# Altium schematic sheet WirlessSpeakerTop.SchDoc
size A4; Date: 27.05.2014; Author: AOM1; DrawnBy: AOM1; Organization: BFH; Address1: Berner Fachhochschule; Address2: Technik und Informatik; Address3: Jlcoweg 1; Address4: 3400 Burgdorf; DocumentNumber: 1; Revision: 1.0; SheetNumber: 1; SheetTotal: 6; CurrentDate: 27.05.2014
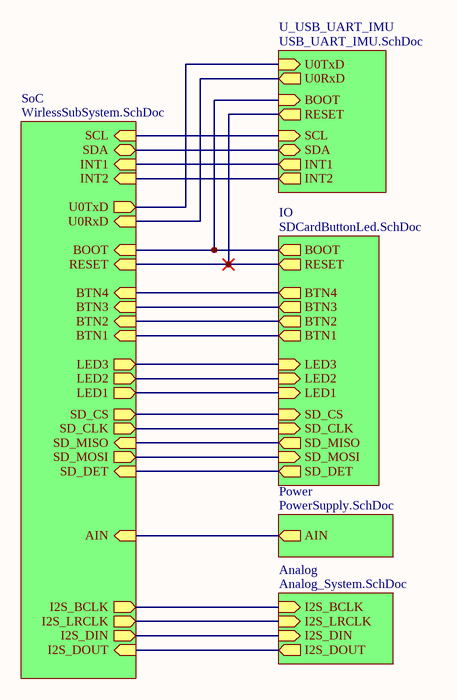
[diagram p0: WirlessSpeakerTop.SchDoc]

## Sub-sheets
Analog = Analog_System.SchDoc: I2S_BCLK (in), I2S_LRCLK (in), I2S_DIN (in), I2S_DOUT (out)
IO = SDCardButtonLed.SchDoc: BOOT (out), RESET (out), BTN1 (out), BTN2 (out), BTN3 (out), BTN4 (out), LED1 (in), LED2 (in), LED3 (in), SD_CS (in), SD_CLK (in), SD_MISO (out), SD_MOSI (in), SD_DET (out)
Power = PowerSupply.SchDoc: AIN (out)
SoC = WirlessSubSystem.SchDoc: U0TxD (out), U0RxD (in), BOOT (in), RESET (in), SCL (in), SDA (bidir), INT1 (in), INT2 (in), BTN1 (in), BTN2 (in), BTN3 (in), BTN4 (in), LED1 (out), LED2 (out), LED3 (out), SD_CS (out), SD_CLK (out), SD_MISO (in), SD_MOSI (out), SD_DET (in), AIN (in), I2S_BCLK (out), I2S_LRCLK (out), I2S_DIN (out), I2S_DOUT (in)
U_USB_UART_IMU = USB_UART_IMU.SchDoc: U0RxD (out), U0TxD (in), BOOT (in), INT1 (out), INT2 (out), SCL (in), SDA (bidir), RESET (out)

## Nets
(unnamed): sheet SoC/U0TxD, sheet U_USB_UART_IMU/U0TxD
(unnamed): sheet SoC/U0RxD, sheet U_USB_UART_IMU/U0RxD
(unnamed): sheet SoC/BOOT, sheet IO/BOOT, sheet U_USB_UART_IMU/BOOT
(unnamed): sheet SoC/RESET, sheet IO/RESET, sheet U_USB_UART_IMU/RESET
(unnamed): sheet SoC/SCL, sheet U_USB_UART_IMU/SCL
(unnamed): sheet SoC/SDA, sheet U_USB_UART_IMU/SDA
(unnamed): sheet SoC/INT1, sheet U_USB_UART_IMU/INT1
(unnamed): sheet SoC/INT2, sheet U_USB_UART_IMU/INT2
(unnamed): sheet SoC/BTN1, sheet IO/BTN1
(unnamed): sheet SoC/BTN2, sheet IO/BTN2
(unnamed): sheet SoC/BTN3, sheet IO/BTN3
(unnamed): sheet SoC/BTN4, sheet IO/BTN4
(unnamed): sheet SoC/LED1, sheet IO/LED1
(unnamed): sheet SoC/LED2, sheet IO/LED2
(unnamed): sheet SoC/LED3, sheet IO/LED3
(unnamed): sheet SoC/SD_CS, sheet IO/SD_CS
(unnamed): sheet SoC/SD_CLK, sheet IO/SD_CLK
(unnamed): sheet SoC/SD_MISO, sheet IO/SD_MISO
(unnamed): sheet SoC/SD_MOSI, sheet IO/SD_MOSI
(unnamed): sheet SoC/SD_DET, sheet IO/SD_DET
(unnamed): sheet SoC/AIN, sheet Power/AIN
(unnamed): sheet SoC/I2S_BCLK, sheet Analog/I2S_BCLK
(unnamed): sheet SoC/I2S_LRCLK, sheet Analog/I2S_LRCLK
(unnamed): sheet SoC/I2S_DIN, sheet Analog/I2S_DIN
(unnamed): sheet SoC/I2S_DOUT, sheet Analog/I2S_DOUT

## Notes on the sheet
- Project Name:
- Title:
- Sheet Size:
- Sheet:
- of
- A4
- Drawn by:
- Time:
- Revision:
- Date:
- File Path: